# EAGLE schematic Tally_v03 (EAGLE 6.4)
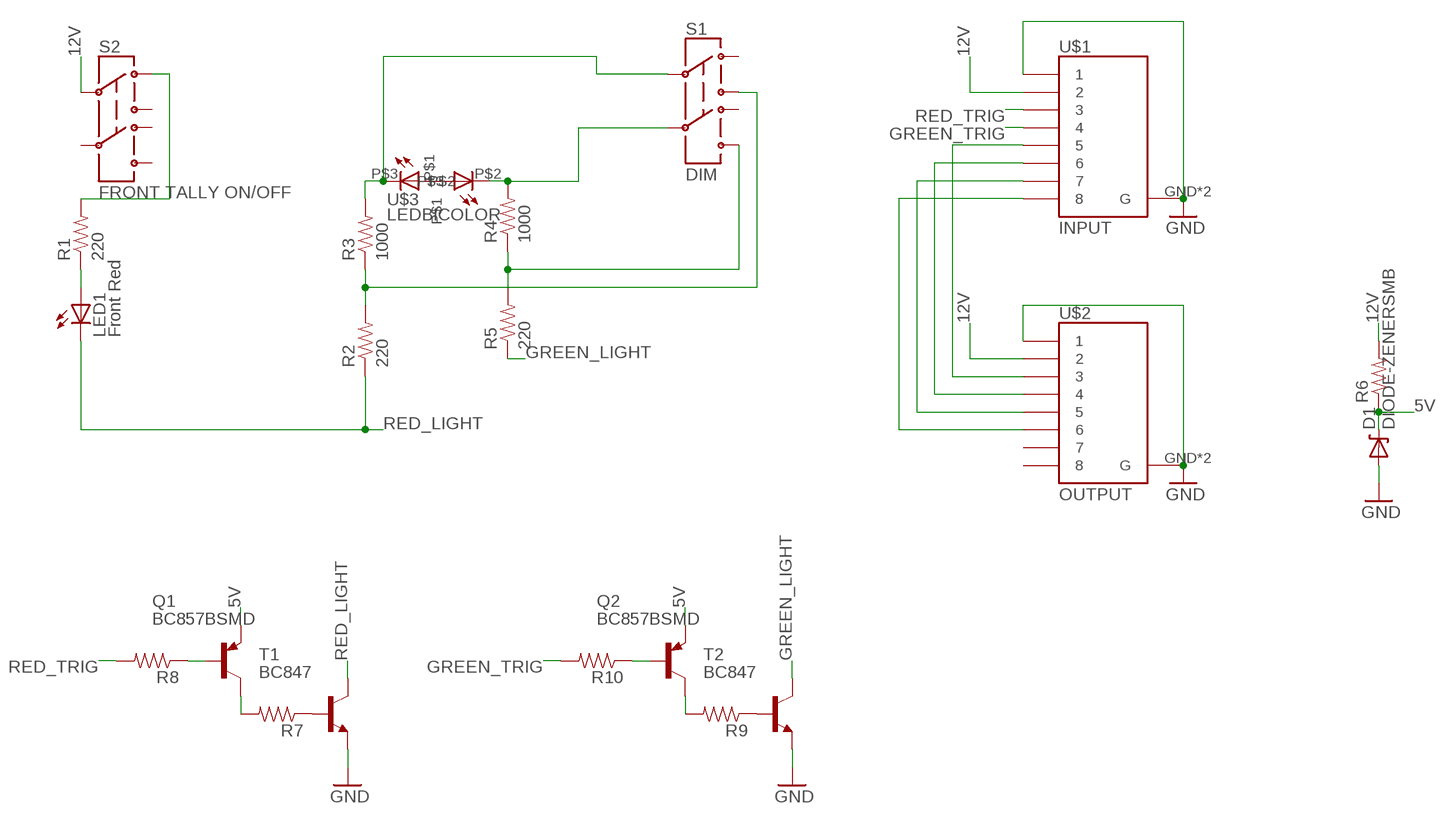
[diagram p0: schematic, sheet 1]

## Parts
D1  DIODE-ZENERSMB  [SMB-DIODE]
LED1  Front Red  LED20  [LED20]
Q1  BC857BSMD  [SOT23-BEC]
Q2  BC857BSMD  [SOT23-BEC]
R1  220  RESISTOR0603-RES  [0603-RES]
R2  220  RESISTOR0603-RES  [0603-RES]
R3  1000  RESISTOR0603-RES  [0603-RES]
R4  1000  RESISTOR0603-RES  [0603-RES]
R5  220  RESISTOR0603-RES  [0603-RES]
R6  RESISTOR0603-RES  [0603-RES]
R7  RESISTOR0603-RES  [0603-RES]
R8  RESISTOR0603-RES  [0603-RES]
R9  RESISTOR0603-RES  [0603-RES]
R10  RESISTOR0603-RES  [0603-RES]
S1  DIM  SWITCH-DPDTPTH1  [TECONNECTIVITY-DPDT]
S2  FRONT TALLY ON/OFF  SWITCH-DPDTPTH1  [TECONNECTIVITY-DPDT]
T1  BC847  [SOT23]
T2  BC847  [SOT23]
U$1  INPUT  RJ45-8_GND  [RJ45-8_GND]
U$2  OUTPUT  RJ45-8_GND  [RJ45-8_GND]
U$3  LEDBICOLOR  [LEDBICOLOR]

## Nets
5V: D1.C Q1.E Q2.E R6.1
12V [POWER]: R6.2 S2.P$2 U$1.2 U$2.2
GND [POWER]: D1.A T1.2(E) T2.2(E) U$1.1 U$1.GND1(G) U$1.GND(G) U$2.1 U$2.GND1(G) U$2.GND(G)
GREEN_LIGHT [POWER]: R5.1 T2.3(C)
GREEN_TRIG: R10.2 U$1.4
N$1 [POWER]: R1.2 S2.P$1
N$2 [POWER]: LED1.P$1(A) R1.1
N$3 [POWER]: R2.2 R3.1 S1.P$3
N$4 [POWER]: R4.1 R5.2 S1.P$6
N$5 [POWER]: R4.2 S1.P$5 U$3.P$2
N$6 [POWER]: R3.2 S1.P$2 U$3.P$3
N$7: U$1.5 U$2.3
N$8: U$1.6 U$2.4
N$9: R7.1 T1.1(B)
N$10: Q1.C R7.2
N$11: U$1.7 U$2.5
N$12: U$1.8 U$2.6
N$13: R9.1 T2.1(B)
N$14: Q2.C R9.2
N$15: Q2.B R10.1
N$16: Q1.B R8.1
RED_LIGHT [POWER]: LED1.P$2(C) R2.1 T1.3(C)
RED_TRIG: R8.2 U$1.3
Unconnected: S1.P$1 S1.P$4 S2.P$3 S2.P$4 S2.P$5 S2.P$6 U$2.7 U$2.8 U$3.P$1

## Library data of the parts
D1 = SparkFun:DIODE-ZENER: Zener Diode Production Part - 8199 3.4V Zener Voltage
LED1 = SKAARHOJ:LED20: KINGBRIGHT 20MM BIG LAMP
Q1 Q2 = transistor-pnp:BC857*: PNP Transistror
R1-R10 = SparkFun:RESISTOR: Resistor Basic schematic elements and footprints for 0603, 1206, and PTH resistors.
S1 S2 = SKAARHOJ:SWITCH-DPDT: DPDT Version of the COM-00597
T1 T2 = transistor:BC847: NPN TRANSISTOR
U$1 U$2 = SKAARHOJ:RJ45-8_GND
U$3 = SKAARHOJ:LEDBICOLOR: L.C.LED N810TGLR2D 10mm Diffused Bicolor Led Lamp (Anode)

## Net classes
0 default: width 0.254 mm, drill 0.559 mm, clearance 0.203 mm
1 POWER: width 0.508 mm, drill 0.686 mm, clearance 0.203 mm